# Altium schematic sheet Project_Top_Arch.SchDoc
size A2; SheetNumber: 2; SheetTotal: 5
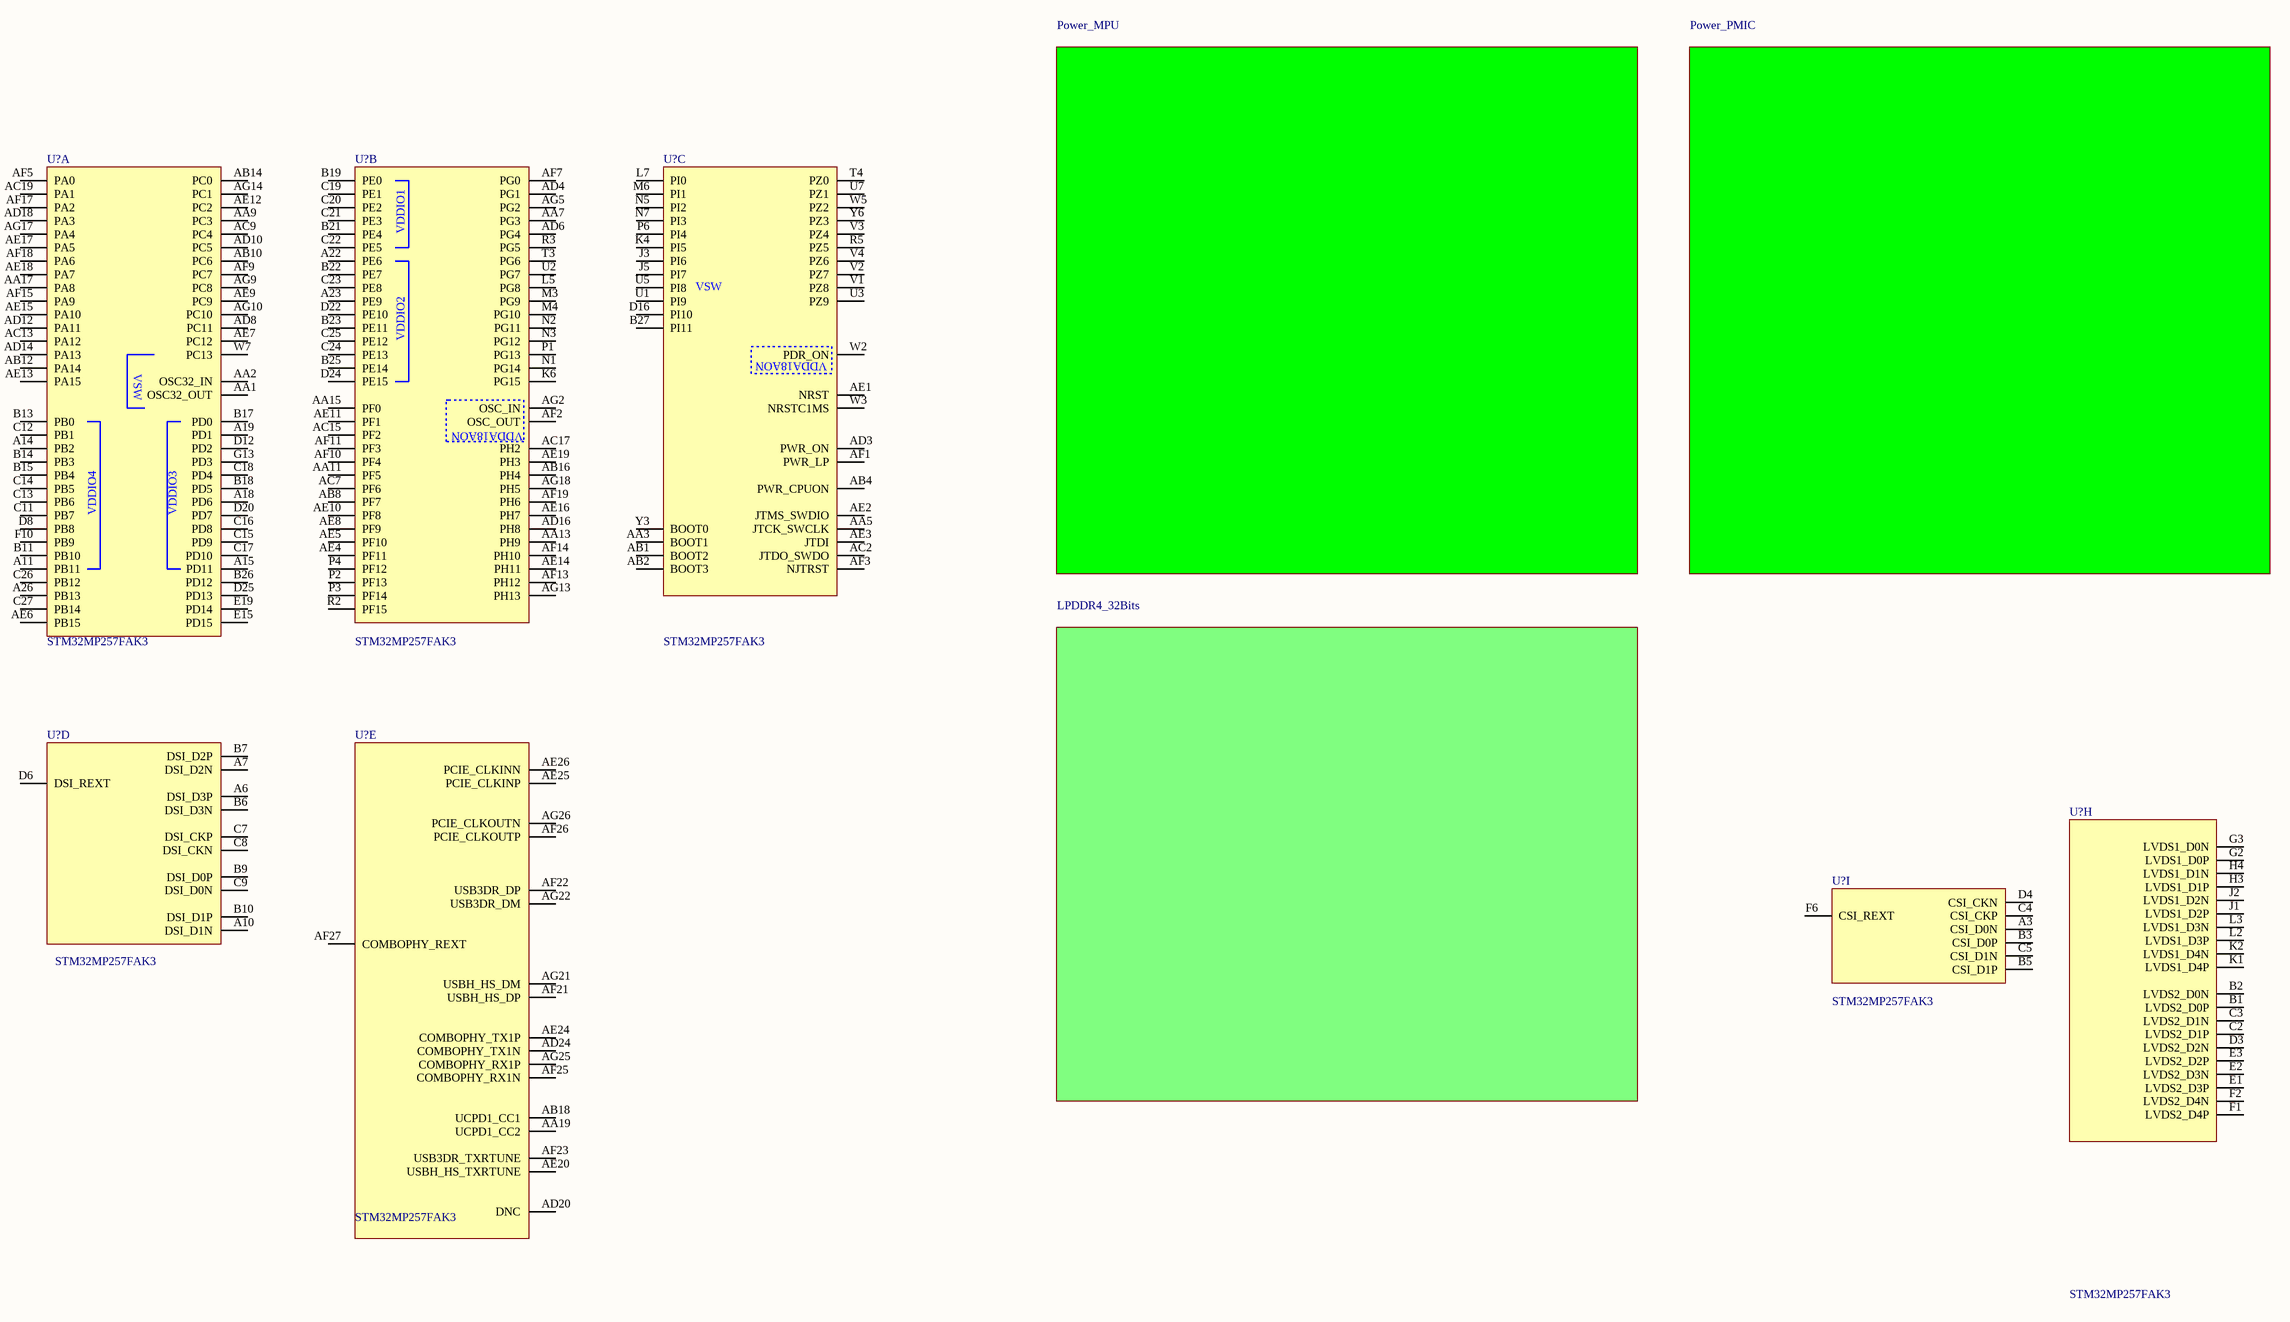
[diagram p0: Project_Top_Arch.SchDoc]

## Parts
(Parts that share a designator on the sheet are numbered #1, #2 ... from top to bottom, then left to right.)
U?#1  STM32MP257FAK3  [ICC_TFBGA424_14X14_P050_H1P20_CODE-B0A2]  (part A of 9)
U?#2  STM32MP257FAK3  [ICC_TFBGA424_14X14_P050_H1P20_CODE-B0A2]  (part B of 9)
U?#3  STM32MP257FAK3  [ICC_TFBGA424_14X14_P050_H1P20_CODE-B0A2]  (part C of 9)
U?#4  STM32MP257FAK3  [ICC_TFBGA424_14X14_P050_H1P20_CODE-B0A2]  (part D of 9)
U?#5  STM32MP257FAK3  [ICC_TFBGA424_14X14_P050_H1P20_CODE-B0A2]  (part E of 9)
U?#6  STM32MP257FAK3  [ICC_TFBGA424_14X14_P050_H1P20_CODE-B0A2]  (part H of 9)
U?#7  STM32MP257FAK3  [ICC_TFBGA424_14X14_P050_H1P20_CODE-B0A2]  (part I of 9)

## Sub-sheets
LPDDR4_32Bits = LPDDR4_32Bits: no entries
Power_MPU = Power_MPU: no entries
Power_PMIC = Power_PMIC: no entries

## Nets

Not connected (* = marked no-connect by the designer): U?#1 A11(PB11) A14(PB2) A15(PD11) A18(PD6) A19(PD1) A26(PB13) AA1(OSC32_OUT) AA2(OSC32_IN) AA9(PC3) AA17(PA8) AB10(PC6) AB12(PA14) AB14(PC0) AC9(PC4) AC13(PA12) AC19(PA1) AD8(PC11) AD10(PC5) AD12(PA11) AD14(PA13) AD18(PA3) AE6(PB15) AE7(PC12) AE9(PC9) AE12(PC2) AE13(PA15) AE15(PA10) AE17(PA5) AE18(PA7) AF5(PA0) AF9(PC7) AF15(PA9) AF17(PA2) AF18(PA6) AG9(PC8) AG10(PC10) AG14(PC1) AG17(PA4) B11(PB10) B13(PB0) B14(PB3) B15(PB4) B17(PD0) B18(PD5) B26(PD12) C11(PB7) C12(PB1) C13(PB6) C14(PB5) C15(PD9) C16(PD8) C17(PD10) C18(PD4) C26(PB12) C27(PB14) D8(PB8) D12(PD2) D20(PD7) D25(PD13) E15(PD15) E19(PD14) F10(PB9) G13(PD3) W7(PC13); U?#2 A22(PE6) A23(PE9) AA7(PG3) AA11(PF5) AA13(PH9) AA15(PF0) AB8(PF7) AB16(PH4) AC7(PF6) AC15(PF2) AC17(PH2) AD4(PG1) AD6(PG4) AD16(PH8) AE4(PF11) AE5(PF10) AE8(PF9) AE10(PF8) AE11(PF1) AE14(PH11) AE16(PH7) AE19(PH3) AF2(OSC_OUT) AF7(PG0) AF10(PF4) AF11(PF3) AF13(PH12) AF14(PH10) AF19(PH6) AG2(OSC_IN) AG5(PG2) AG13(PH13) AG18(PH5) B19(PE0) B21(PE4) B22(PE7) B23(PE11) B25(PE14) C19(PE1) C20(PE2) C21(PE3) C22(PE5) C23(PE8) C24(PE13) C25(PE12) D22(PE10) D24(PE15) K6(PG15) L5(PG8) M3(PG9) M4(PG10) N1(PG14) N2(PG11) N3(PG12) P1(PG13) P2(PF13) P3(PF14) P4(PF12) R2(PF15) R3(PG5) T3(PG6) U2(PG7); U?#3 AA3(BOOT1) AA5(JTCK_SWCLK) AB1(BOOT2) AB2(BOOT3) AB4(PWR_CPUON) AC2(JTDO_SWDO) AD3(PWR_ON) AE1(NRST) AE2(JTMS_SWDIO) AE3(JTDI) AF1(PWR_LP) AF3(NJTRST) B27(PI11) D16(PI10) J3(PI6) J5(PI7) K4(PI5) L7(PI0) M6(PI1) N5(PI2) N7(PI3) P6(PI4) R5(PZ5) T4(PZ0) U1(PI9) U3(PZ9) U5(PI8) U7(PZ1) V1(PZ8) V2(PZ7) V3(PZ4) V4(PZ6) W2(PDR_ON) W3(NRSTC1MS) W5(PZ2) Y3(BOOT0) Y6(PZ3); U?#4 A6(DSI_D3P) A7(DSI_D2N) A10(DSI_D1N) B6(DSI_D3N) B7(DSI_D2P) B9(DSI_D0P) B10(DSI_D1P) C7(DSI_CKP) C8(DSI_CKN) C9(DSI_D0N) D6(DSI_REXT); U?#5 AA19(UCPD1_CC2) AB18(UCPD1_CC1) AD20(DNC) AD24(COMBOPHY_TX1N) AE20(USBH_HS_TXRTUNE) AE24(COMBOPHY_TX1P) AE25(PCIE_CLKINP) AE26(PCIE_CLKINN) AF21(USBH_HS_DP) AF22(USB3DR_DP) AF23(USB3DR_TXRTUNE) AF25(COMBOPHY_RX1N) AF26(PCIE_CLKOUTP) AF27(COMBOPHY_REXT) AG21(USBH_HS_DM) AG22(USB3DR_DM) AG25(COMBOPHY_RX1P) AG26(PCIE_CLKOUTN); U?#6 B1(LVDS2_D0P) B2(LVDS2_D0N) C2(LVDS2_D1P) C3(LVDS2_D1N) D3(LVDS2_D2N) E1(LVDS2_D3P) E2(LVDS2_D3N) E3(LVDS2_D2P) F1(LVDS2_D4P) F2(LVDS2_D4N) G2(LVDS1_D0P) G3(LVDS1_D0N) H3(LVDS1_D1P) H4(LVDS1_D1N) J1(LVDS1_D2P) J2(LVDS1_D2N) K1(LVDS1_D4P) K2(LVDS1_D4N) L2(LVDS1_D3P) L3(LVDS1_D3N); U?#7 A3(CSI_D0N) B3(CSI_D0P) B5(CSI_D1P) C4(CSI_CKP) C5(CSI_D1N) D4(CSI_CKN) F6(CSI_REXT)

## Notes on the sheet
- (in symbol STM32MP257FAK3_1, part A) VSW
- (in symbol STM32MP257FAK3_1, part C) VSW

## Library data of the parts
U?#1-U?#7 = STM32MP257FAK3_1: MPU , 2xCortex-A35@1.5GHz, Cortex-M33@400MHz, TFBGA 14x14, pitch 0.5, 648KB SRAM, With Crypto; Internal_Part_Number: MCD-03375; Part_Type: IC; Part_Preference: Recommended; Manufacturer: STMICROELECTRONICS; Component_Country_Of_Origin: Unknown; ShowFields: YES; ID: 5491; Value: STM32MP257FAK3; Status: Checked; Manufacturer_Part_Number: STM32MP257FAK3; Package: TFBGA; ComponentLink1URL: http://tunmcdsvn.tun.st.com/Component_Documentation_Library/Trunk/IC/STMICROELECTRONICS_STM32MP257FAK3; Order_Code_Digikey: N/A; Order_Code_Farnell: N/A; Order_Code_RS: N/A